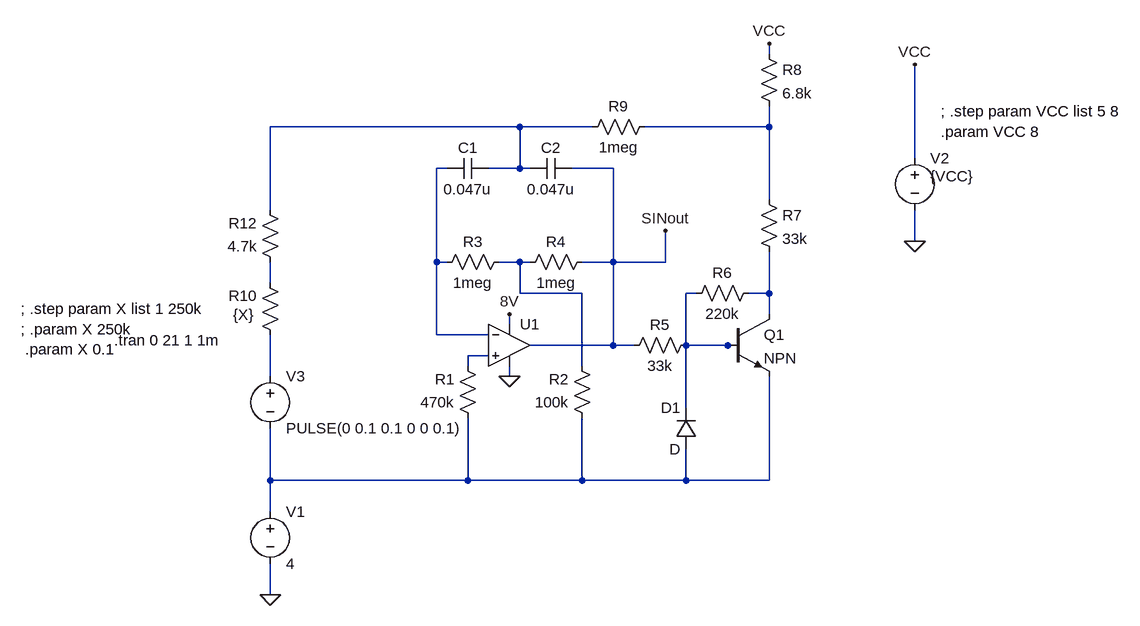
[diagram p0: schematic LFO_VB-2_sine.asc]
LFO_VB-2_sine.asc, the LTspice schematic file:
Version 4
SHEET 1 1440 680
WIRE 576 -256 576 -272
WIRE 192 -144 -192 -144
WIRE 304 -144 192 -144
WIRE 576 -144 576 -176
WIRE 576 -144 384 -144
WIRE 800 -96 800 -240
WIRE 80 -80 64 -80
WIRE 192 -80 192 -144
WIRE 192 -80 144 -80
WIRE 208 -80 192 -80
WIRE 336 -80 272 -80
WIRE 576 -32 576 -144
WIRE -192 -16 -192 -144
WIRE 800 32 800 -16
WIRE 64 64 64 -80
WIRE 80 64 64 64
WIRE 192 64 160 64
WIRE 208 64 192 64
WIRE 336 64 336 -80
WIRE 336 64 288 64
WIRE 416 64 416 16
WIRE 416 64 336 64
WIRE -192 96 -192 64
WIRE 192 112 192 64
WIRE 288 112 192 112
WIRE 464 112 448 112
WIRE 576 112 576 48
WIRE 576 112 544 112
WIRE 576 144 576 112
WIRE 176 160 176 144
WIRE 64 176 64 64
WIRE 144 176 64 176
WIRE 336 192 336 64
WIRE 336 192 208 192
WIRE 368 192 336 192
WIRE 448 192 448 112
WIRE 512 192 448 192
WIRE 528 192 512 192
WIRE 144 208 112 208
WIRE 112 224 112 208
WIRE 288 224 288 112
WIRE -192 240 -192 176
WIRE 176 240 176 224
WIRE 448 288 448 192
WIRE -192 400 -192 320
WIRE 112 400 112 304
WIRE 112 400 -192 400
WIRE 288 400 288 304
WIRE 288 400 112 400
WIRE 448 400 448 352
WIRE 448 400 288 400
WIRE 576 400 576 240
WIRE 576 400 448 400
WIRE -192 448 -192 400
WIRE -192 576 -192 528
FLAG 176 240 0
FLAG 176 144 8V
FLAG 800 32 0
FLAG -192 576 0
FLAG 576 -272 VCC
FLAG 800 -240 VCC
FLAG 416 16 SINout
SYMBOL res 128 320 R180
WINDOW 0 36 76 Left 2
WINDOW 3 36 40 Left 2
SYMATTR InstName R1
SYMATTR Value 470k
SYMBOL res 304 320 R180
WINDOW 0 36 76 Left 2
WINDOW 3 36 40 Left 2
SYMATTR InstName R2
SYMATTR Value 100k
SYMBOL res 64 80 R270
WINDOW 0 32 56 VTop 2
WINDOW 3 0 56 VBottom 2
SYMATTR InstName R3
SYMATTR Value 1meg
SYMBOL res 192 80 R270
WINDOW 0 32 56 VTop 2
WINDOW 3 0 56 VBottom 2
SYMATTR InstName R4
SYMATTR Value 1meg
SYMBOL res 352 208 R270
WINDOW 0 32 56 VTop 2
WINDOW 3 0 56 VBottom 2
SYMATTR InstName R5
SYMATTR Value 33k
SYMBOL res 448 128 R270
WINDOW 0 32 56 VTop 2
WINDOW 3 0 56 VBottom 2
SYMATTR InstName R6
SYMATTR Value 220k
SYMBOL res 560 -48 R0
SYMATTR InstName R7
SYMATTR Value 33k
SYMBOL res 560 -272 R0
SYMATTR InstName R8
SYMATTR Value 6.8k
SYMBOL res 400 -160 R90
WINDOW 0 0 56 VBottom 2
WINDOW 3 32 56 VTop 2
SYMATTR InstName R9
SYMATTR Value 1meg
SYMBOL res -176 192 R180
WINDOW 0 36 76 Left 2
WINDOW 3 41 47 Left 2
SYMATTR InstName R10
SYMATTR Value {X}
SYMBOL cap 144 -96 R90
WINDOW 0 0 32 VBottom 2
WINDOW 3 32 32 VTop 2
SYMATTR InstName C1
SYMATTR Value 0.047u
SYMBOL cap 272 -96 R90
WINDOW 0 0 32 VBottom 2
WINDOW 3 32 32 VTop 2
SYMATTR InstName C2
SYMATTR Value 0.047u
SYMBOL diode 464 352 R180
WINDOW 0 24 64 Left 2
WINDOW 3 24 0 Left 2
SYMATTR InstName D1
SYMBOL voltage -192 432 R0
WINDOW 123 0 0 Left 2
WINDOW 39 0 0 Left 2
SYMATTR InstName V1
SYMATTR Value 4
SYMBOL voltage 800 -112 R0
WINDOW 3 24 44 Left 2
WINDOW 123 0 0 Left 2
WINDOW 39 0 0 Left 2
SYMATTR Value {VCC}
SYMATTR InstName V2
SYMBOL res -176 80 R180
WINDOW 0 36 76 Left 2
WINDOW 3 36 40 Left 2
SYMATTR InstName R12
SYMATTR Value 4.7k
SYMBOL Opamps\\UniversalOpamp2 176 192 R0
SYMATTR InstName U1
SYMBOL voltage -192 224 R0
WINDOW 123 0 0 Left 2
WINDOW 39 0 0 Left 2
SYMATTR InstName V3
SYMATTR Value PULSE(0 0.1 0.1 0 0 0.1)
SYMBOL npn 512 144 R0
SYMATTR InstName Q1
TEXT -576 136 Left 2 !; .step param X list 1 250k\n; .param X 250k\n .param X 0.1
TEXT -432 184 Left 2 !.tran 0 21 1 1m
TEXT 840 -168 Left 2 !; .step param VCC list 5 8\n.param VCC 8

The netlist it stands for:
* LFO_VB-2_sine.asc
R1 N010 N008 470k
R2 N010 N004 100k
R3 N003 N004 1meg
R4 N004 SINout 1meg
R5 SINout N006 33k
R6 N006 N007 220k
R7 N002 N007 33k
R8 VCC N002 6.8k
R9 N002 N001 1meg
R10 N009 N005 {X}
C1 N001 N003 0.047u
C2 SINout N001 0.047u
D1 N010 N006 D
V1 N010 0 4
V2 VCC 0 {VCC}
R12 N005 N001 4.7k
XU1 N008 N003 8V 0 SINout level.2 Avol=1Meg GBW=10Meg Slew=10Meg ilimit=25m rail=0 Vos=0 phimargin=45 en=0 enk=0 in=0 ink=0 Rin=500Meg  ; pins IN+ IN- V+ V- OUT
V3 N009 N010 PULSE(0 0.1 0.1 0 0 0.1)
Q1 N007 N006 N010 0 NPN
.model D D
.lib standard.dio
.model NPN NPN
.model PNP PNP
.lib standard.bjt
; .step param X list 1 250k
; .param X 250k
 .param X 0.1
.tran 0 21 1 1m
; .step param VCC list 5 8
.param VCC 8
.lib UniversalOpamps2.sub
.backanno
.end